# Altium schematic sheet CarrierConnector.SchDoc
size A4; CompanyName: Technische Hochschule Nürnberg Georg Simon Ohm; Organization: UltraZohm; Address1: Kesslerplatz 12; Address2: 90489 Nürnberg; Address3: GERMANY; DocumentNumber: 2; SheetNumber: 2; SheetTotal: 3; Website: www.ultrazohm.com
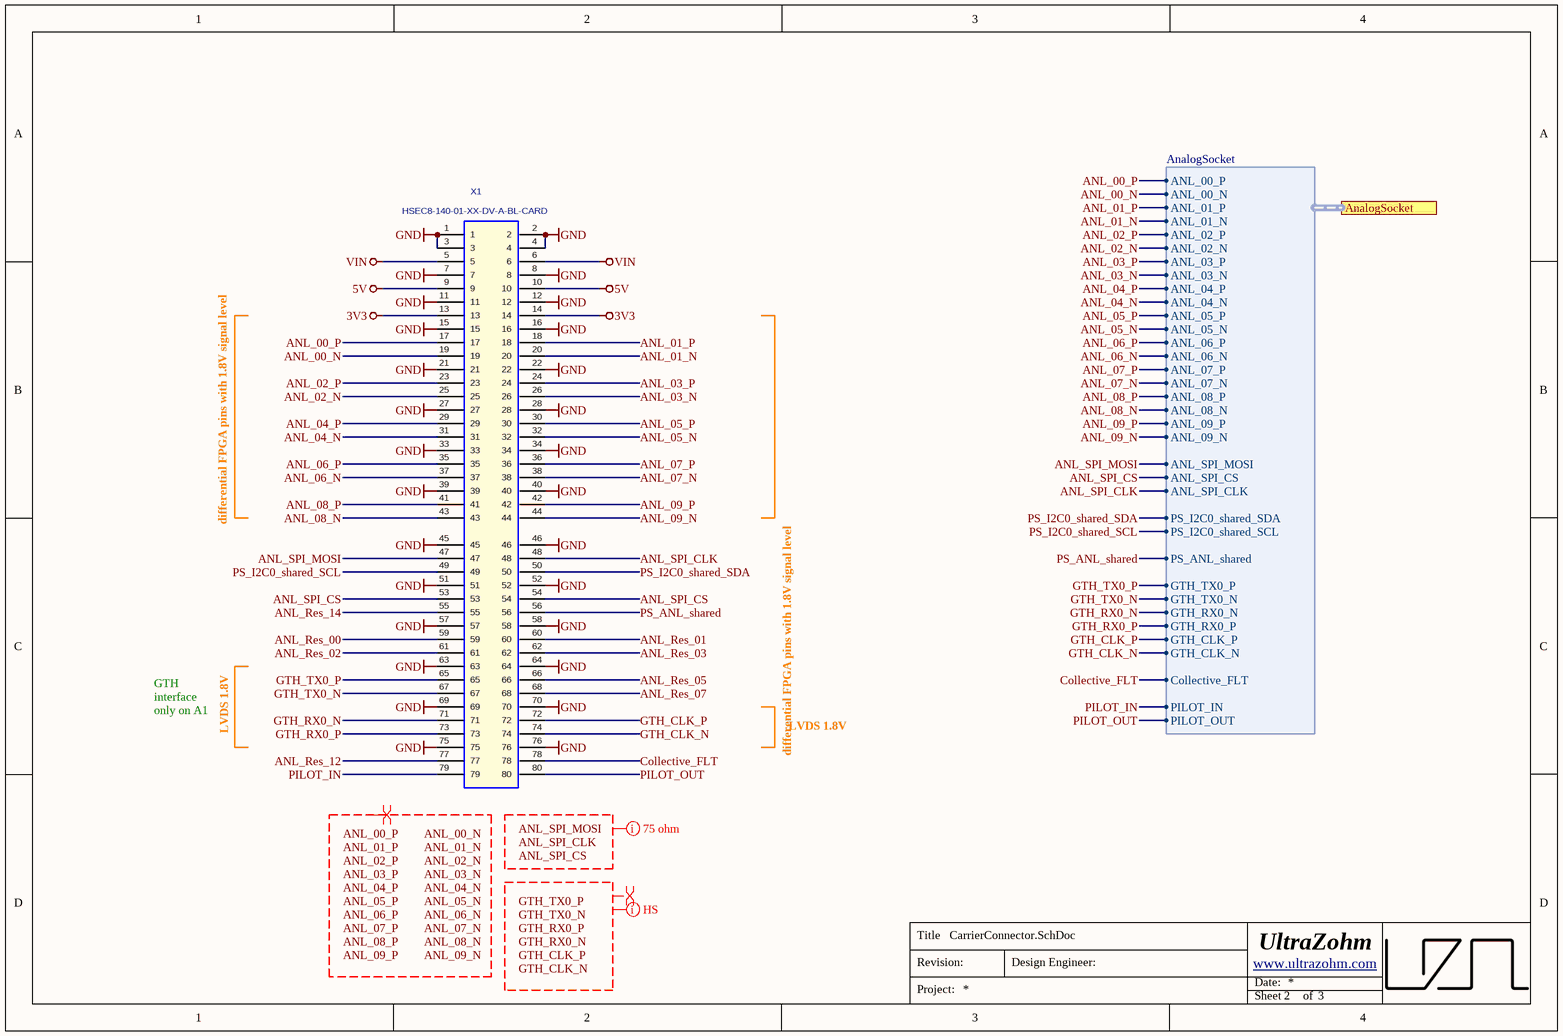
[diagram p0: CarrierConnector.SchDoc]

## Parts
X1  HSEC8-140-01-XX-DV-A-BL-CARD  [HSEC8-140-01-XX-DV-A-BL-CARD]  (no BOM)

## Ports
AnalogSocket (harness AnalogSocket)

## Harnesses
AnalogSocket: ANL_01_P, ANL_01_N, ANL_03_P, ANL_03_N, ANL_05_P, ANL_05_N, ANL_07_P, ANL_07_N, ANL_00_P, ANL_00_N, ANL_02_P, ANL_02_N, ANL_04_P, ANL_04_N, ANL_06_P, ANL_06_N, ANL_08_P, ANL_08_N, ANL_09_P, ANL_09_N, ANL_SPI_MOSI, ANL_SPI_CS, ANL_SPI_CLK, PS_I2C0_shared_SDA, PS_I2C0_shared_SCL, PS_ANL_shared, GTH_TX0_P, GTH_TX0_N, GTH_RX0_N, GTH_RX0_P, GTH_CLK_P, GTH_CLK_N, Collective_FLT, PILOT_IN, PILOT_OUT

## Nets
3V3: X1.13 X1.14
5V: X1.9 X1.10
GND: X1.1 X1.2 X1.3 X1.4 X1.7 X1.8 X1.11 X1.12 X1.15 X1.16 X1.21 X1.22 X1.27 X1.28 X1.33 X1.34 X1.39 X1.40 X1.45 X1.46 X1.51 X1.52 X1.57 X1.58 X1.63 X1.64 X1.69 X1.70 X1.75 X1.76
VIN: X1.5 X1.6
ANL_00_N: X1.19 ; port AnalogSocket.ANL_00_N
ANL_00_P: X1.17 ; port AnalogSocket.ANL_00_P
ANL_01_N: X1.20 ; port AnalogSocket.ANL_01_N
ANL_01_P: X1.18 ; port AnalogSocket.ANL_01_P
ANL_02_N: X1.25 ; port AnalogSocket.ANL_02_N
ANL_02_P: X1.23 ; port AnalogSocket.ANL_02_P
ANL_03_N: X1.26 ; port AnalogSocket.ANL_03_N
ANL_03_P: X1.24 ; port AnalogSocket.ANL_03_P
ANL_04_N: X1.31 ; port AnalogSocket.ANL_04_N
ANL_04_P: X1.29 ; port AnalogSocket.ANL_04_P
ANL_05_N: X1.32 ; port AnalogSocket.ANL_05_N
ANL_05_P: X1.30 ; port AnalogSocket.ANL_05_P
ANL_06_N: X1.37 ; port AnalogSocket.ANL_06_N
ANL_06_P: X1.35 ; port AnalogSocket.ANL_06_P
ANL_07_N: X1.38 ; port AnalogSocket.ANL_07_N
ANL_07_P: X1.36 ; port AnalogSocket.ANL_07_P
ANL_08_N: X1.43 ; port AnalogSocket.ANL_08_N
ANL_08_P: X1.41 ; port AnalogSocket.ANL_08_P
ANL_09_N: X1.44 ; port AnalogSocket.ANL_09_N
ANL_09_P: X1.42 ; port AnalogSocket.ANL_09_P
ANL_Res_00: X1.59
ANL_Res_01: X1.60
ANL_Res_02: X1.61
ANL_Res_03: X1.62
ANL_Res_05: X1.66
ANL_Res_07: X1.68
ANL_Res_12: X1.77
ANL_Res_14: X1.55
ANL_SPI_CLK: X1.48 ; port AnalogSocket.ANL_SPI_CLK
ANL_SPI_CS: X1.53 X1.54 ; port AnalogSocket.ANL_SPI_CS
ANL_SPI_MOSI: X1.47 ; port AnalogSocket.ANL_SPI_MOSI
Collective_FLT: X1.78 ; port AnalogSocket.Collective_FLT
GTH_CLK_N: X1.74 ; port AnalogSocket.GTH_CLK_N
GTH_CLK_P: X1.72 ; port AnalogSocket.GTH_CLK_P
GTH_RX0_N: X1.71 ; port AnalogSocket.GTH_RX0_N
GTH_RX0_P: X1.73 ; port AnalogSocket.GTH_RX0_P
GTH_TX0_N: X1.67 ; port AnalogSocket.GTH_TX0_N
GTH_TX0_P: X1.65 ; port AnalogSocket.GTH_TX0_P
PILOT_IN: X1.79 ; port AnalogSocket.PILOT_IN
PILOT_OUT: X1.80 ; port AnalogSocket.PILOT_OUT
PS_ANL_shared: X1.56 ; port AnalogSocket.PS_ANL_shared
PS_I2C0_shared_SCL: X1.49 ; port AnalogSocket.PS_I2C0_shared_SCL
PS_I2C0_shared_SDA: X1.50 ; port AnalogSocket.PS_I2C0_shared_SDA

## Layout directives
net class S75: ANL_SPI_CLK, ANL_SPI_CS, ANL_SPI_MOSI
differential pair: ANL_00_N, ANL_00_P, ANL_01_N, ANL_01_P, ANL_02_N, ANL_02_P, ANL_03_N, ANL_03_P, ANL_04_N, ANL_04_P, ANL_05_N, ANL_05_P, ANL_06_N, ANL_06_P, ANL_07_N, ANL_07_P, ANL_08_N, ANL_08_P, ANL_09_N, ANL_09_P, GTH_CLK_N, GTH_CLK_P, GTH_RX0_N, GTH_RX0_P, GTH_TX0_N, GTH_TX0_P
net class HS: GTH_CLK_N, GTH_CLK_P, GTH_RX0_N, GTH_RX0_P, GTH_TX0_N, GTH_TX0_P

## Notes on the sheet
- differential FPGA pins with 1.8V signal level
- GTH interface only on A1
- LVDS 1.8V
- Labels drawn without touching a wire or pin: ANL_00_N, ANL_00_P, ANL_01_N, ANL_01_P, ANL_02_N, ANL_02_P, ANL_03_N, ANL_03_P, ANL_04_N, ANL_04_P, ANL_05_N, ANL_05_P, ANL_06_N, ANL_06_P, ANL_07_N, ANL_07_P, ANL_08_N, ANL_08_P, ANL_09_N, ANL_09_P, ANL_SPI_CLK, ANL_SPI_CS, ANL_SPI_MOSI, GTH_CLK_N, GTH_CLK_P, GTH_RX0_N, GTH_RX0_P, GTH_TX0_N, GTH_TX0_P
- Title
- Revision:
- Design Engineer:
- Date:
- Project:
- Sheet
- of

## Library data of the parts
X1 = HSEC8-140-01-XX-DV-A-BL-CARD: Mating Card Layout for HSEC8-140-01-XX-DV-A-BL-CARD; Manufacturer: SAMTEC; Created from: MHlatky; Number of positions: 100; Created: 2018_04_23_AGeiger; Value: HSEC8-140-01-XX-DV-A-BL-CARD; Manufacturer Part Number: HSEC8-140-01-XX-DV-A-BL-CARD; PartID: 21; Created On: 26.02.2021 16:36:12; ComponentLink1Description: Homepage; ComponentLink1URL: https://www.samtec.com/products/hsec8-dp; Component Type: Board to Board Connector; Device Package: PCB Shape; Last Updated: 26.02.2021 16:37:20; Mounting Type: PCB Shape; Series: HSEC8; Supplier 1: SAMTEC; Supplier Part Number 1: NA; Type: Board to Board Connector; Live Cycle Status: 1; Stock number: not stored; Number of rows: 2